# Altium schematic sheet LCD_Screen.SchDoc: LCD Screen
size A; Author: Michael Ashford; CompanyName: BYUI; DrawnBy: Michael Ashford; Engineer: Michael Ashford; DocumentNumber: 3; Revision: 0.0.1; SheetNumber: 3; SheetTotal: 15
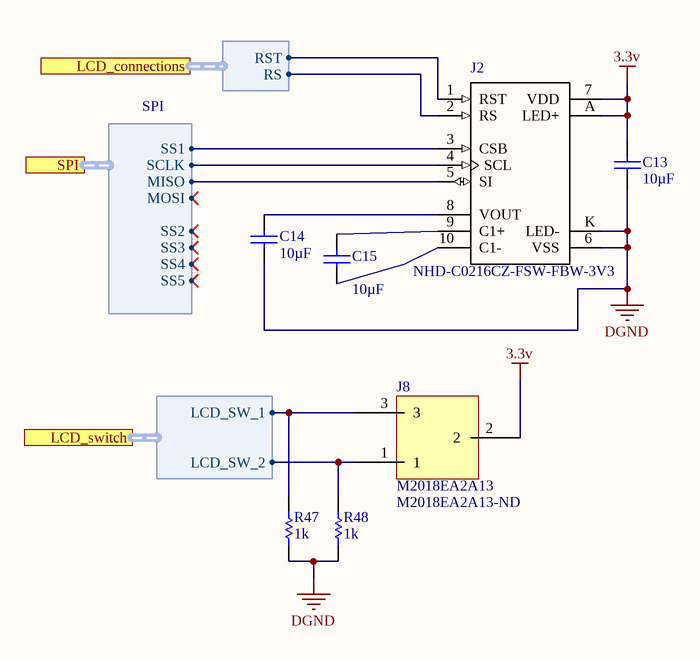
[diagram p0: LCD_Screen.SchDoc]

## Parts
C13  Capacitance: 10µF  [CAPC1608X90X20LL10]  (hidden comment: C1608X5R1A106K080AC)
C14  Capacitance: 10µF  [CAPC1608X90X20LL10]  (hidden comment: C1608X5R1A106K080AC)
C15  Capacitance: 10µF  [CAPC1608X90X20LL10]  (hidden comment: C1608X5R1A106K080AC)
J2  NHD-C0216CZ-FSW-FBW-3V3  [*LCD_NHD-C0216CZ-FSW-FBW-3V3_NHD-C0216CZ-FSW-FBW-3V3(Primary)]
J8  M2018EA2A13  Supplier Part Number 1: M2018EA2A13-ND  [M2018EA2A13]
R47  1k  [RESC1608X55X30LL20T20]
R48  1k  [RESC1608X55X30LL20T20]

## Ports
LCD_connections (harness LCD_connections), LCD_switch (harness LCD_switch), SPI (harness SPI)

## Harnesses
SPI: SCLK, MOSI, MISO, SS1, SS2, SS3, SS4, SS5
LCD_connections: RST, RS
LCD_switch: LCD_SW_1, LCD_SW_2

## Nets
3.3v: C13.2 J2.7(VDD) J2.A(LED+) J8.2
DGND: C13.1 C14.1 J2.6(VSS) J2.K(LED-) R47.1 R48.1
NetC14_2: C14.2 J2.8(VOUT)
NetC15_1: C15.1 J2.10(C1-)
NetC15_2: C15.2 J2.9(C1+)
NetJ2_1: J2.1(RST) ; port LCD_connections.RST
NetJ2_2: J2.2(RS) ; port LCD_connections.RS
NetJ2_3: J2.3(CSB) ; port SPI.SS1
NetJ2_4: J2.4(SCL) ; port SPI.SCLK
NetJ2_5: J2.5(SI) ; port SPI.MISO
NetJ8_1: J8.1 R48.2 ; port LCD_switch.LCD_SW_2
NetJ8_3: J8.3 R47.2 ; port LCD_switch.LCD_SW_1

## Library data of the parts
C13-C15 = CMP-2000-04979-1: Chip Capacitor, 10 uF, +/- 10%, 10 V, -55 to 85 degC, 0603 (1608 Metric), RoHS, Tape and Reel; PCN Part Number: MLCCPartNumberChange30/Nov/2012; Manufacturer: TDK; Temperature Coefficient: X5R; Product Training Modules: CSeriesGeneralApplicationsSEAT,CCV,andTVCLDesignToolsGuidetoReplacinganElectrolyticCapacitorwithanMLCC; Online Catalog: CSeries,GeneralPurpose; Voltage - Rated: 10V; Other Names: 445-7486-1; Design Resources: 20WNon-IsolatedBuckLEDDriverUsingPLLNK460KG; Kits: 445-9003-KIT-ND-KITCAPCERHICAPMLCCSMD; Height - Seated (Max): -; Family: CeramicCapacitors; Package Description: 2-Pin Surface Mount Device, Body 1.6 x 0.8 mm; Category: Capacitors; Datasheet Version: Mar-15; RoHS Information: RoHSCertificate-MLCC; Thickness (Max): 0.035"(0.90mm); Operating Temperature: -55degC~85degC; Package Reference: 603; Series: C; Applications: GeneralPurpose; Datasheet URL: http://download.siliconexpert.com/pdfs/2015/4/21/15/54/45/779/tdk_/manual/37024850441143360mlcc_commercial_general_en.pdf; Features: -; Lead Style: -; Lead Spacing: -; Ratings: -; Size / Dimension: 0.063"Lx0.031"W(1.60mmx0.80mm); Tolerance: ±10%; Mounting Type: SurfaceMount,MLCC; Standard Package: 1; Package / Case: 0603(1608Metric); Manufacturer URL: http://www.tdk.com/; Packaging: CutTape(CT); Manufacturer Part Number: C1608X5R1A106K080AC
J2 = NHD-C0216CZ-FSW-FBW-3V3: Character LCD Display Module Transflective 5 x 8 Dots FSTN - Film Super-Twisted Nematic LED - White Serial 41.40mm x 24.30mm x 4.00mm; MF: Newhaven Display; Package: None; Digi-Key_Part_Number: NHD-C0216CZ-FSW-FBW-3V3-ND; MP: NHD-C0216CZ-FSW-FBW-3V3; SnapEDA_Link: https://www.snapeda.com/parts/NHD-C0216CZ-FSW-FBW-3V3/Newhaven%20Display%20Intl/view-part/217645/?ref=snap; Digi-Key_Purchase_URL: https://www.digikey.com/product-detail/en/newhaven-display-intl/NHD-C0216CZ-FSW-FBW-3V3/NHD-C0216CZ-FSW-FBW-3V3-ND/2059234?utm_source=snapeda&utm_medium=aggregator&utm_campaign=symbol; Value: *
J8 = M2018EA2A13: SWITCH TOGGLE SPDT 6A 125V; Manufacturer: NKK Switches; Mechanical Life: 50000Cycles; Actuator Material: Brass,Chrome; Voltage Rating (DC): 30V; Current Rating: 3A; Max Voltage Rating (AC): 250V; Contact Resistance: 20mR; Illumination Type: Non-Illuminated; Electrical Life: 25000Cycles; Switch Function: Mom-Off-Mom; Actuator Length: 13.21mm; Supplier 1: Digi-Key; Manufacturer Part Number: M2018EA2A13; RoHS: Yes; Category: Toggle Switches; Stock 1: 87; Pricing 1: 1=7.80000, 10=7.41000, 25=7.21520, 50=7.02000, 100=6.82500, 250=6.43500, 500=5.46000, 1000=5.16750 (USD); Mount: Through Hole,Brackets; Contact Plating: Gold; Contact Material: Silver; Min Operating Temperature: -30°C; Max Operating Temperature: 85°C; Throw Configuration: SPDT; Package Quantity: 1; Voltage Rating (AC): 125V; Termination: PC Pin; Packaging: Bulk; Max Voltage Rating (DC): 30V; Life (Cycles): 50000Cycles; Orientation: Straight; Lead Free: Lead Free; ComponentLink1URL: https://datasheet.ciiva.com/2907/mtogglesbracketpc-2907069.pdf?src-supplier=Digi-Key; ComponentLink1Description: https://datasheet.ciiva.com/2907/mtogglesbracketpc-2907069.pdf?src-supplier=Digi-Key
R47 R48 = CMP-2000-00873-1: Manufacturer: Panasonic; Part Number: ERA3AEB102V